# Altium project MainTeam5.PrjPCB
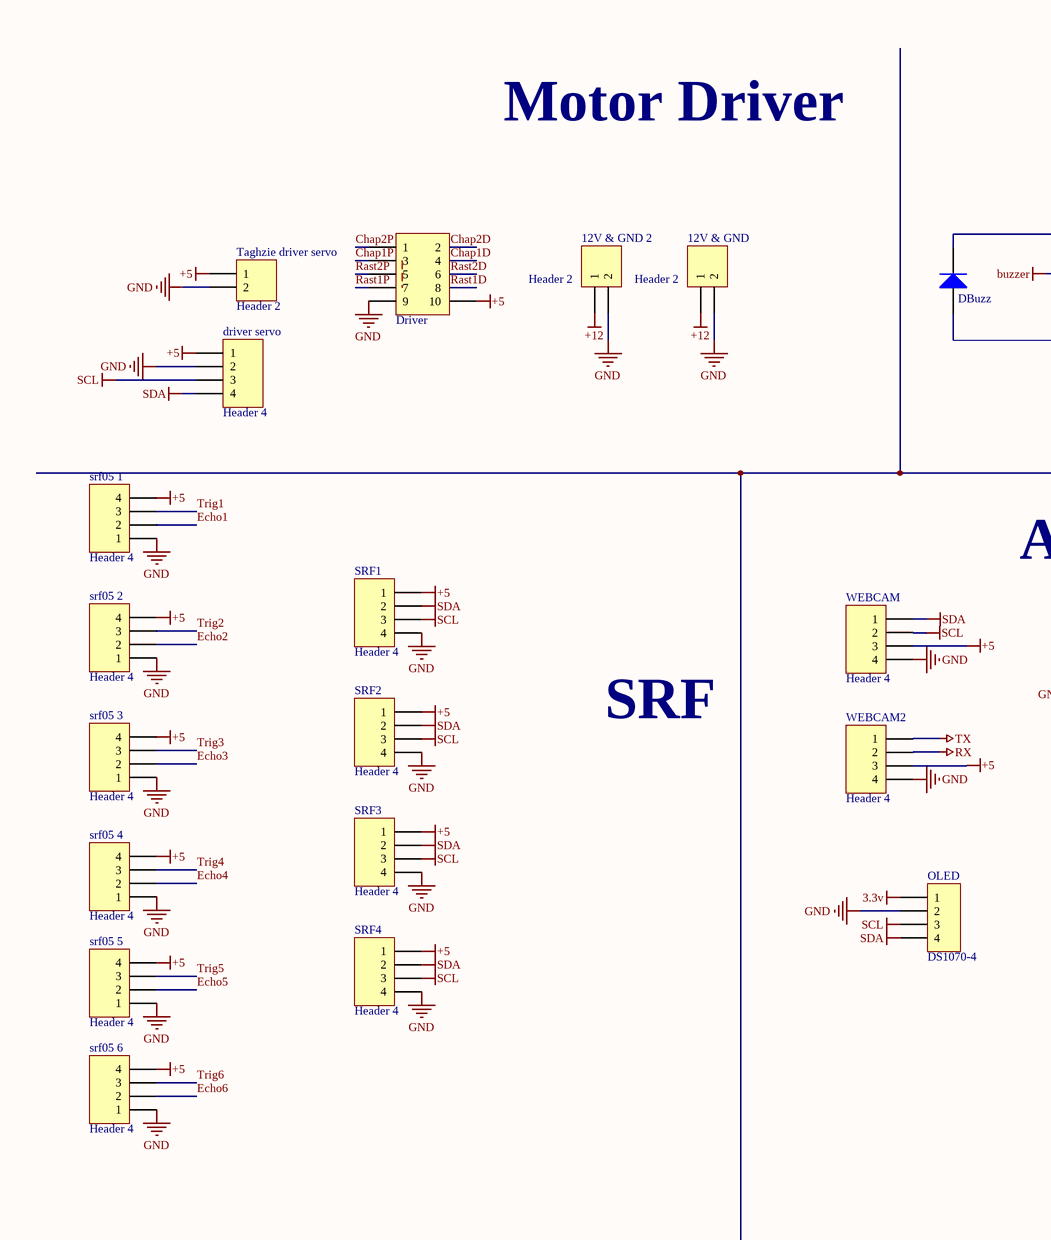
[diagram p0: MainTeam5.SchDoc, left]
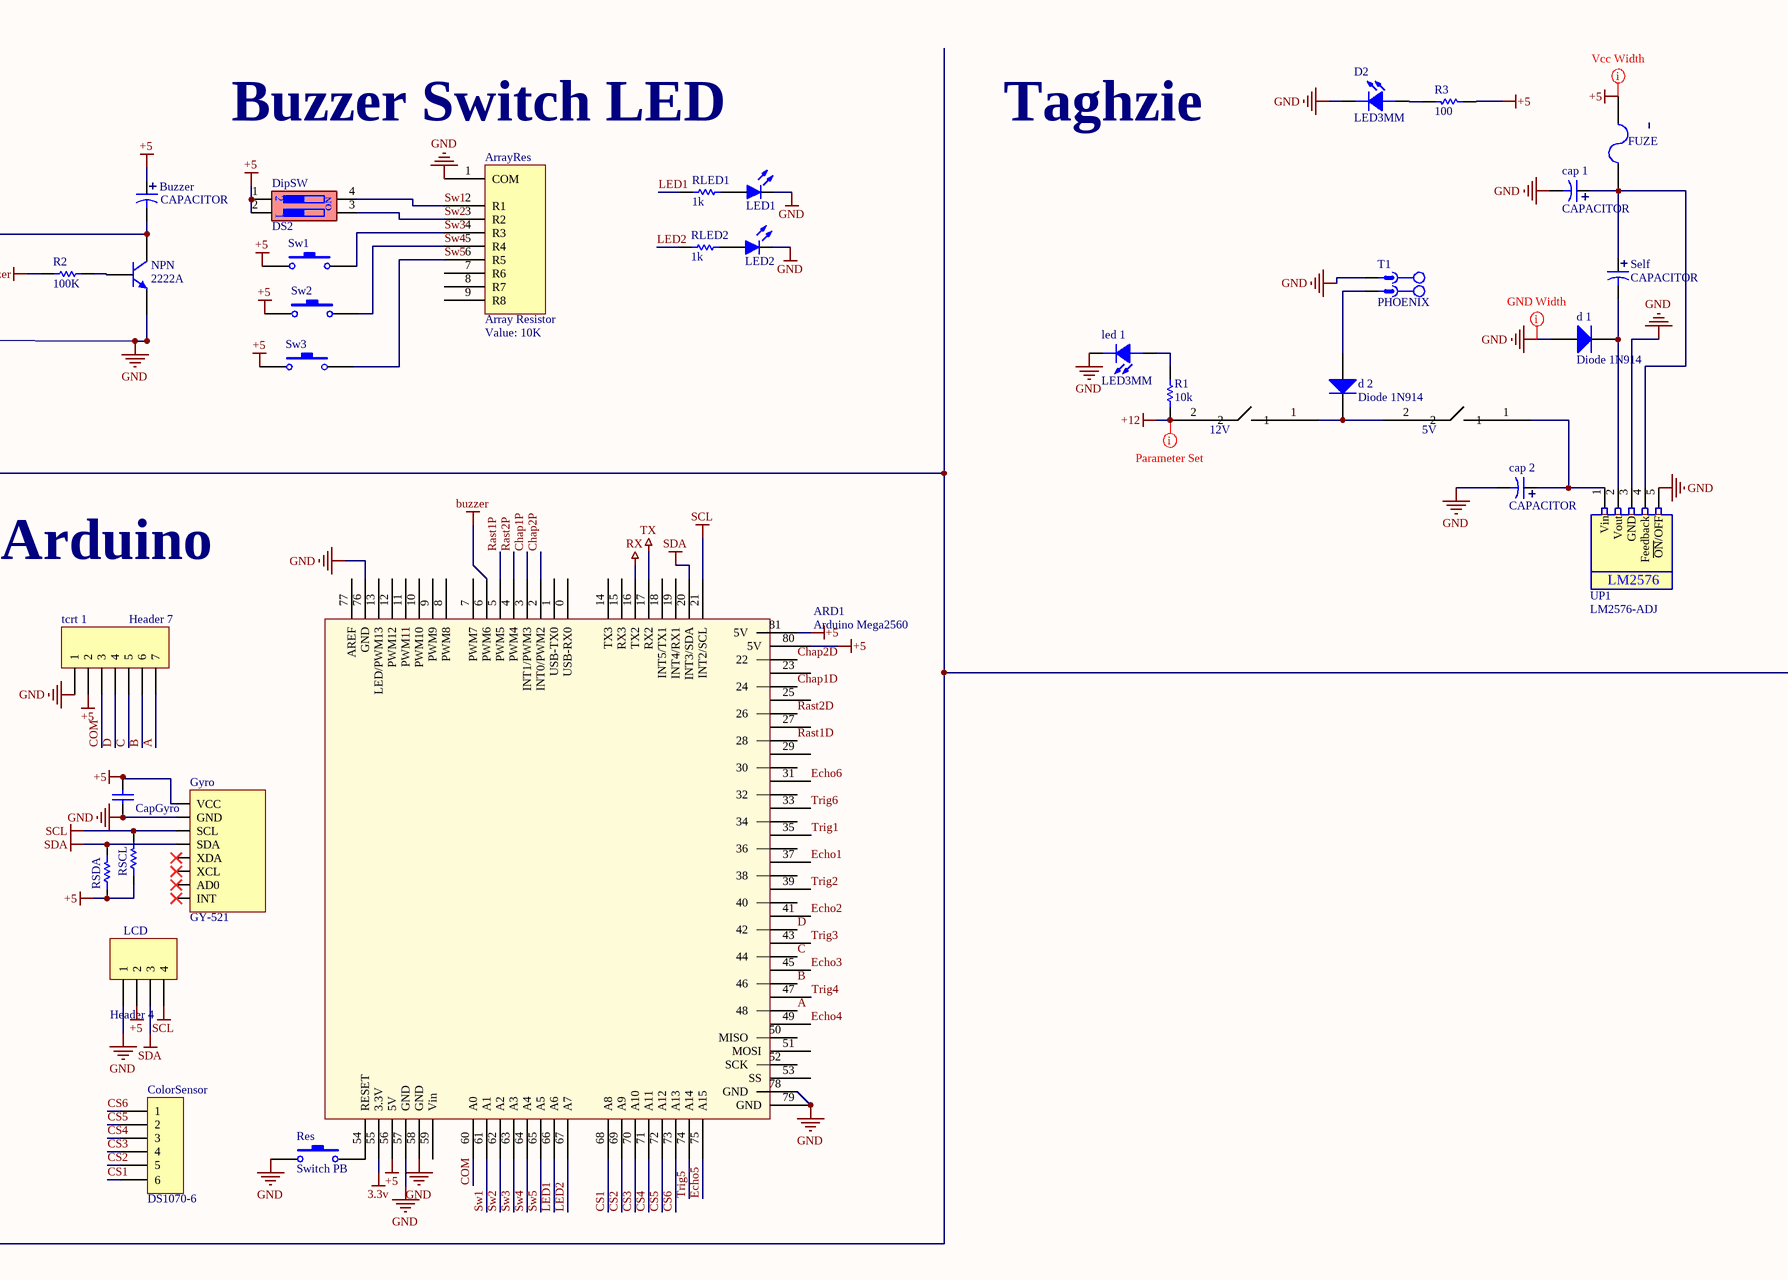
[diagram p1: MainTeam5.SchDoc, right]
1 sheet, 54 parts. Net scope: global (net labels, ports and power ports of the same name join across sheets).
Board file: MainTeam5.PcbDoc

## Sheet MainTeam5.SchDoc
size D

### Parts
5V  Component_1  [Switch power]  (value not drawn)
12V  Component_1  [Switch power]  (value not drawn)
12V_&_GND  Header 2  [DS1070-2]
12V_&_GND_2  Header 2  [DS1070-2]
ARD1  Arduino Mega2560  [Arduino_Mega2560]
ArrayRes  Array Resistor  value 10K  [Res Array]
Buzzer  CAPACITOR  [Buzzer-5mm]
cap_1  CAPACITOR  [C2200UF-10V_10*16]
cap_2  CAPACITOR  [C2200UF-10V_10*16]
CapGyro  (no value)  [Cap - 100nF]
ColorSensor  DS1070-6  [DS1070-6]
D2  LED3MM  [LED3mm_GRN]
d_1  Diode 1N914  [Diode 1W]
d_2  Diode 1N914  [Diode 1W]
DBuzz  1N4148  [LL4148]  (value not drawn)
DipSW  DS2  [DIP Switch x2]
Driver  CONNECTOR_IDC_5X2  [IDC2.54-10PIN]  (value not drawn)
driver_servo  Header 4  [HDR1X4]
FUZE  F=1.0 A  [1206 FUSE]  (value not drawn)
Gyro  GY-521  [Gy-521]
LCD  Header 4  [DS1070-4]
LED1  LED-SMD  [0805 LED]  (value not drawn)
LED2  LED-SMD  [0805 LED]  (value not drawn)
led_1  LED3MM  [LED3mm_GRN]
NPN  2222A  [TO-92 BENT]
OLED  DS1070-4  [DS1070-4]
R1  10k  [RESC3413X04N]
R2  100K  [RESC3413X04N]
R3  100  [RESC3413X04N]
Res  Switch PB  [Switch - Push to On]
RLED1  1k  [1206]
RLED2  1k  [1206]
RSCL  1K  [RES 0805 (2012X06L)]  (value not drawn)
RSDA  1K  [RES 0805 (2012X06L)]  (value not drawn)
Self  CAPACITOR  [C2200UF-10V_10*16]
SRF1  Header 4  [DS1070-4]
SRF2  Header 4  [DS1070-4]
SRF3  Header 4  [DS1070-4]
SRF4  Header 4  [DS1070-4]
srf05_1  Header 4  [DS1070-4]
srf05_2  Header 4  [DS1070-4]
srf05_3  Header 4  [DS1070-4]
srf05_4  Header 4  [DS1070-4]
srf05_5  Header 4  [DS1070-4]
srf05_6  Header 4  [DS1070-4]
Sw1  Switch PB  [Switch - Push to On]  (value not drawn)
Sw2  Switch PB  [Switch - Push to On]  (value not drawn)
Sw3  Switch PB  [Switch - Push to On]  (value not drawn)
T1  PHOENIX  [MSTB 2,5/2-G-5,08]
Taghzie_driver_servo  Header 2  [HDR1X2]
tcrt_1  Header 7  [HDR1X7]
UP1  LM2576-ADJ  [LM2576 SMD]
WEBCAM  Header 4  [DS1070-4]
WEBCAM2  Header 4  [DS1070-4]

### Nets
3.3v: ARD1.55(3.3V) OLED.1
+5: ARD1.56(5V) ARD1.80(5V) ARD1.81(5V) Buzzer.1 CapGyro.2 DipSW.1 DipSW.2 Driver.10 driver_servo.1 FUZE.2 Gyro.1(VCC) LCD.2 R3.2 RSCL.1 RSDA.1 SRF1.1 SRF2.1 SRF3.1 SRF4.1 srf05_1.4 srf05_2.4 srf05_3.4 srf05_4.4 srf05_5.4 srf05_6.4 Sw1.1 Sw2.1 Sw3.1 Taghzie_driver_servo.1 tcrt_1.2 WEBCAM.3 WEBCAM2.3
+12: 12V.2 12V_&_GND.1 12V_&_GND_2.1 R1.1
buzzer: ARD1.6(PWM6) R2.1
GND: 12V_&_GND.2 12V_&_GND_2.2 ARD1.57(GND) ARD1.58(GND) ARD1.76(GND) ARD1.78(GND) ARD1.79(GND) ArrayRes.1(COM) cap_1.2(-) cap_2.2(-) CapGyro.1 D2.2(CATHODE) d_1.1(A) DBuzz.1(A) Driver.9 driver_servo.2 Gyro.2(GND) LCD.1 LED1.2 LED2.2 led_1.2(CATHODE) NPN.3(E) OLED.2 Res.1 SRF1.4 SRF2.4 SRF3.4 SRF4.4 srf05_1.1 srf05_2.1 srf05_3.1 srf05_4.1 srf05_5.1 srf05_6.1 T1.1 Taghzie_driver_servo.2 tcrt_1.1 UP1.3(GND) UP1.5(~{ON}/OFF) WEBCAM.4 WEBCAM2.4
RX: ARD1.16(TX2) WEBCAM2.2
SCL: ARD1.21(INT2/SCL) driver_servo.3 Gyro.3(SCL) LCD.4 OLED.3 RSCL.2 SRF1.3 SRF2.3 SRF3.3 SRF4.3 WEBCAM.2
SDA: ARD1.20(INT3/SDA) driver_servo.4 Gyro.4(SDA) LCD.3 OLED.4 RSDA.2 SRF1.2 SRF2.2 SRF3.2 SRF4.2 WEBCAM.1
TX: ARD1.17(RX2) WEBCAM2.1
A: ARD1.48 tcrt_1.7
B: ARD1.46 tcrt_1.6
C: ARD1.44 tcrt_1.5
Chap1D: ARD1.24 Driver.4
Chap1P: ARD1.3(INT1/PWM3) Driver.3
Chap2D: ARD1.22 Driver.2
Chap2P: ARD1.2(INT0/PWM2) Driver.1
COM: ARD1.60(A0) tcrt_1.3
CS1: ARD1.68(A8) ColorSensor.6
CS2: ARD1.69(A9) ColorSensor.5
CS3: ARD1.70(A10) ColorSensor.4
CS4: ARD1.71(A11) ColorSensor.3
CS5: ARD1.72(A12) ColorSensor.2
CS6: ARD1.73(A13) ColorSensor.1
D: ARD1.42 tcrt_1.4
Echo1: ARD1.37 srf05_1.2
Echo2: ARD1.41 srf05_2.2
Echo3: ARD1.45 srf05_3.2
Echo4: ARD1.49 srf05_4.2
Echo5: ARD1.75(A15) srf05_5.2
Echo6: ARD1.31 srf05_6.2
LED1: ARD1.66(A6) RLED1.1
LED2: ARD1.67(A7) RLED2.1
Rast1D: ARD1.28 Driver.8
Rast1P: ARD1.5(PWM5) Driver.7
Rast2D: ARD1.26 Driver.6
Rast2P: ARD1.4(PWM4) Driver.5
Sw1: ARD1.61(A1) ArrayRes.2(R1) DipSW.4
Sw2: ARD1.62(A2) ArrayRes.3(R2) DipSW.3
Sw3: ARD1.63(A3) ArrayRes.4(R3) Sw1.2
Sw4: ARD1.64(A4) ArrayRes.5(R4) Sw2.2
Sw5: ARD1.65(A5) ArrayRes.6(R5) Sw3.2
Trig1: ARD1.35 srf05_1.3
Trig2: ARD1.39 srf05_2.3
Trig3: ARD1.43 srf05_3.3
Trig4: ARD1.47 srf05_4.3
Trig5: ARD1.74(A14) srf05_5.3
Trig6: ARD1.33 srf05_6.3
Net5V_1: 5V.1 cap_2.1 UP1.1(Vin)
Net5V_2: 5V.2 12V.1 d_2.2(K)
NetARD1_54: ARD1.54(RESET) Res.2
NetBuzzer_2: Buzzer.2(-) DBuzz.2(K) NPN.1(C)
Netcap_1_1: cap_1.1 FUZE.1 Self.1 UP1.4(Feedback)
NetD2_1: D2.1(ANODE) R3.1
Netd_1_2: d_1.2(K) Self.2(-) UP1.2(Vout)
Netd_2_1: d_2.1(A) T1.2
NetLED1_1: LED1.1 RLED1.2
NetLED2_1: LED2.1 RLED2.2
Netled_1_1: led_1.1(ANODE) R1.2
NetNPN_2: NPN.2(B) R2.2

Not connected (* = marked no-connect by the designer): ARD1 0(USB-RX0) 1(USB-TX0) 7(PWM7) 8(PWM8) 9(PWM9) 10(PWM10) 11(PWM11) 12(PWM12) 13(LED/PWM13) 14(TX3) 15(RX3) 18(INT5/TX1) 19(INT4/RX1) 23 25 27 29 30 32 34 36 38 40 50(MISO) 51(MOSI) 52(SCK) 53(SS) 59(Vin) 77(AREF); ArrayRes 7(R6) 8(R7) 9(R8); Gyro 5(XDA)* 6(XCL)* 7(AD0)* 8(INT)*

### Layout directives
rule Width Constraint [Pref Width = 2.5mm    Min Width = 1mm    Max Width = 3mm]: +12
rule Width Constraint [Pref Width = 1.5mm    Min Width = 1mm    Max Width = 2mm]: +5, GND

### Notes on the sheet
- Motor Driver
- Buzzer Switch LED
- Taghzie
- Arduino
- SRF
- (in symbol DIP Switch 2) ON
- (in symbol LM2576-Adj) LM2576

### Library data of the parts
12V_&_GND 12V_&_GND_2 Taghzie_driver_servo = Header 2: Header, 2-Pin; LatestRevisionDate: 17-Jul-2002; LatestRevisionNote: Re-released for DXP Platform.; Publisher: Altium Limited
ArrayRes = Res Array: Resistor Pack
CapGyro = Cap CBB22 105J400V: Polypropylene film with epoxy Cap CBB22 105J400V; Manufacturer: CHINA; Designer: Abbas Basereh; Data: 16-12-2016; Link: https://www.alibaba.com/product-detail/CBB22-capacitors-105J-400V-1UF-400V_60020643516.html; Part. No: 105J400V
D2 led_1 = LED 3MM: Light Emitting Diode; Designer: Ali Hafizi
d_1 d_2 = Diode 1N914: High Conductance Fast Diode; Published: 8-Jun-2000; LatestRevisionDate: 17-Jul-2002; LatestRevisionNote: Re-released for DXP Platform.; DatasheetVersion: 1997; PackageReference: DO-35; Publisher: Altium Limited; PackageDescription: Diode, Axial; Body 3.8 x 1.9 mm (LxDia. max), Lead Dia. 0.53 mm (max); Code_JEDEC: DO-204-AH; ComponentLink1Description: Manufacturer Link; ComponentLink1URL: http://www.fairchildsemi.com/; ComponentLink2Description: Datasheet; ComponentLink2URL: http://www.fairchildsemi.com/ds/1N%2F1N4448.pdf
DBuzz = Diode 1N4148: High Conductance Fast Diode; Published: 8-Jun-2000; LatestRevisionDate: 17-Jul-2002; LatestRevisionNote: Re-released for DXP Platform.; DatasheetVersion: 1997; PackageReference: DO-35; Publisher: Altium Limited; PackageDescription: Diode, Axial; Body 3.8 x 1.9 mm (LxDia. max), Lead Dia. 0.53 mm (max); Code_JEDEC: DO-204-AH; ComponentLink1Description: Manufacturer Link; ComponentLink1URL: http://www.fairchildsemi.com/; ComponentLink2Description: Datasheet; ComponentLink2URL: http://www.fairchildsemi.com/ds/1N%2F1N4148.pdf
DipSW = DIP Switch 2: 2 BIT DIP Switch
Driver = IDC 5X2: IDC, 5-Pin, Dual row; Manufacturer: CHINA; designer: ABBAS BASEREH; Connector type: IDC5X2  PROGPIN; Max Current: mA; LatestRevisionDate: 1395-11-17; Publisher: ABBAS BASEREH; Mounting Technology: Through-Hole; Category: Connector; Pin Count: 10; Status: Unreleased; ComponentLink1Description: Datasheet; ComponentLink2Description: Reference; Update: 2017-2-4
driver_servo LCD SRF1-SRF4 srf05_1-srf05_6 WEBCAM WEBCAM2 = Header 4: Header, 4-Pin; LatestRevisionDate: 17-Jul-2002; LatestRevisionNote: Re-released for DXP Platform.; Publisher: Altium Limited
FUZE = Fuse SMD1206: SMD Fuses 1206; Designer: Abbas Basereh; Desc.: SMD Fuses 1206; Data: 16-12-2016
NPN = BC547: NPN General-purpose Transistor; Designer: Abbas Basereh; Desc.: Plastic Medium-Power. Silicon NPN Transistors; Data: 27-12-2016
R1-R3 = RES 0805 0.125W: RES 0805; Designer: Abbas Basereh; Desc.: RES SMD 0805; Data: 16-12-2016
Res Sw1-Sw3 = Switch PB: Push Button Switch
RLED1 RLED2 = RESISTOR
RSCL RSDA = Resistor: Tolerance: 5%; Power: 1/8 W; Value: 1K
T1 = CON_Phoenix_MSTB_02: 2 Pitch: 5.08 mm Color: green Contact surface: Tin Assembly; Manufacturer: PHOENIX CONTACT; Connector type: PCB Terminal Block; designer: ABBAS BASEREH; Max Current: 12 A; Positions: 2; Voltage: 320 V; Category: Connector; ComponentLink1Description: Header, Nominal current: 12 A Rated voltage (III/2): 320 V Number of positions: 2 Pitch: 5.08 mm Color: green Contact surface: Tin Assembly: Soldering  DESIGNER:ABBAS BASEREH; ComponentLink2Description: Reference; Mounting Technology: Through-Hole; Pin Count: 2; Revision 1: 2017-3-1; Status: Unreleased; PART.NO: PHOENIX
tcrt_1 = Header 7: Header, 7-Pin; LatestRevisionDate: 17-Jul-2002; LatestRevisionNote: Re-released for DXP Platform.; Publisher: Altium Limited
UP1 = LM2576-Adj: 1.2-50V, 3A variable output step-down switching voltage regulator; Designer: Abbas Basereh; Data: 16-12-2016; Link: *; Part.No: *; VALUE: LM2576-ADJ